# EAGLE design BT AQ DOL R5 (EAGLE 9.6.2)
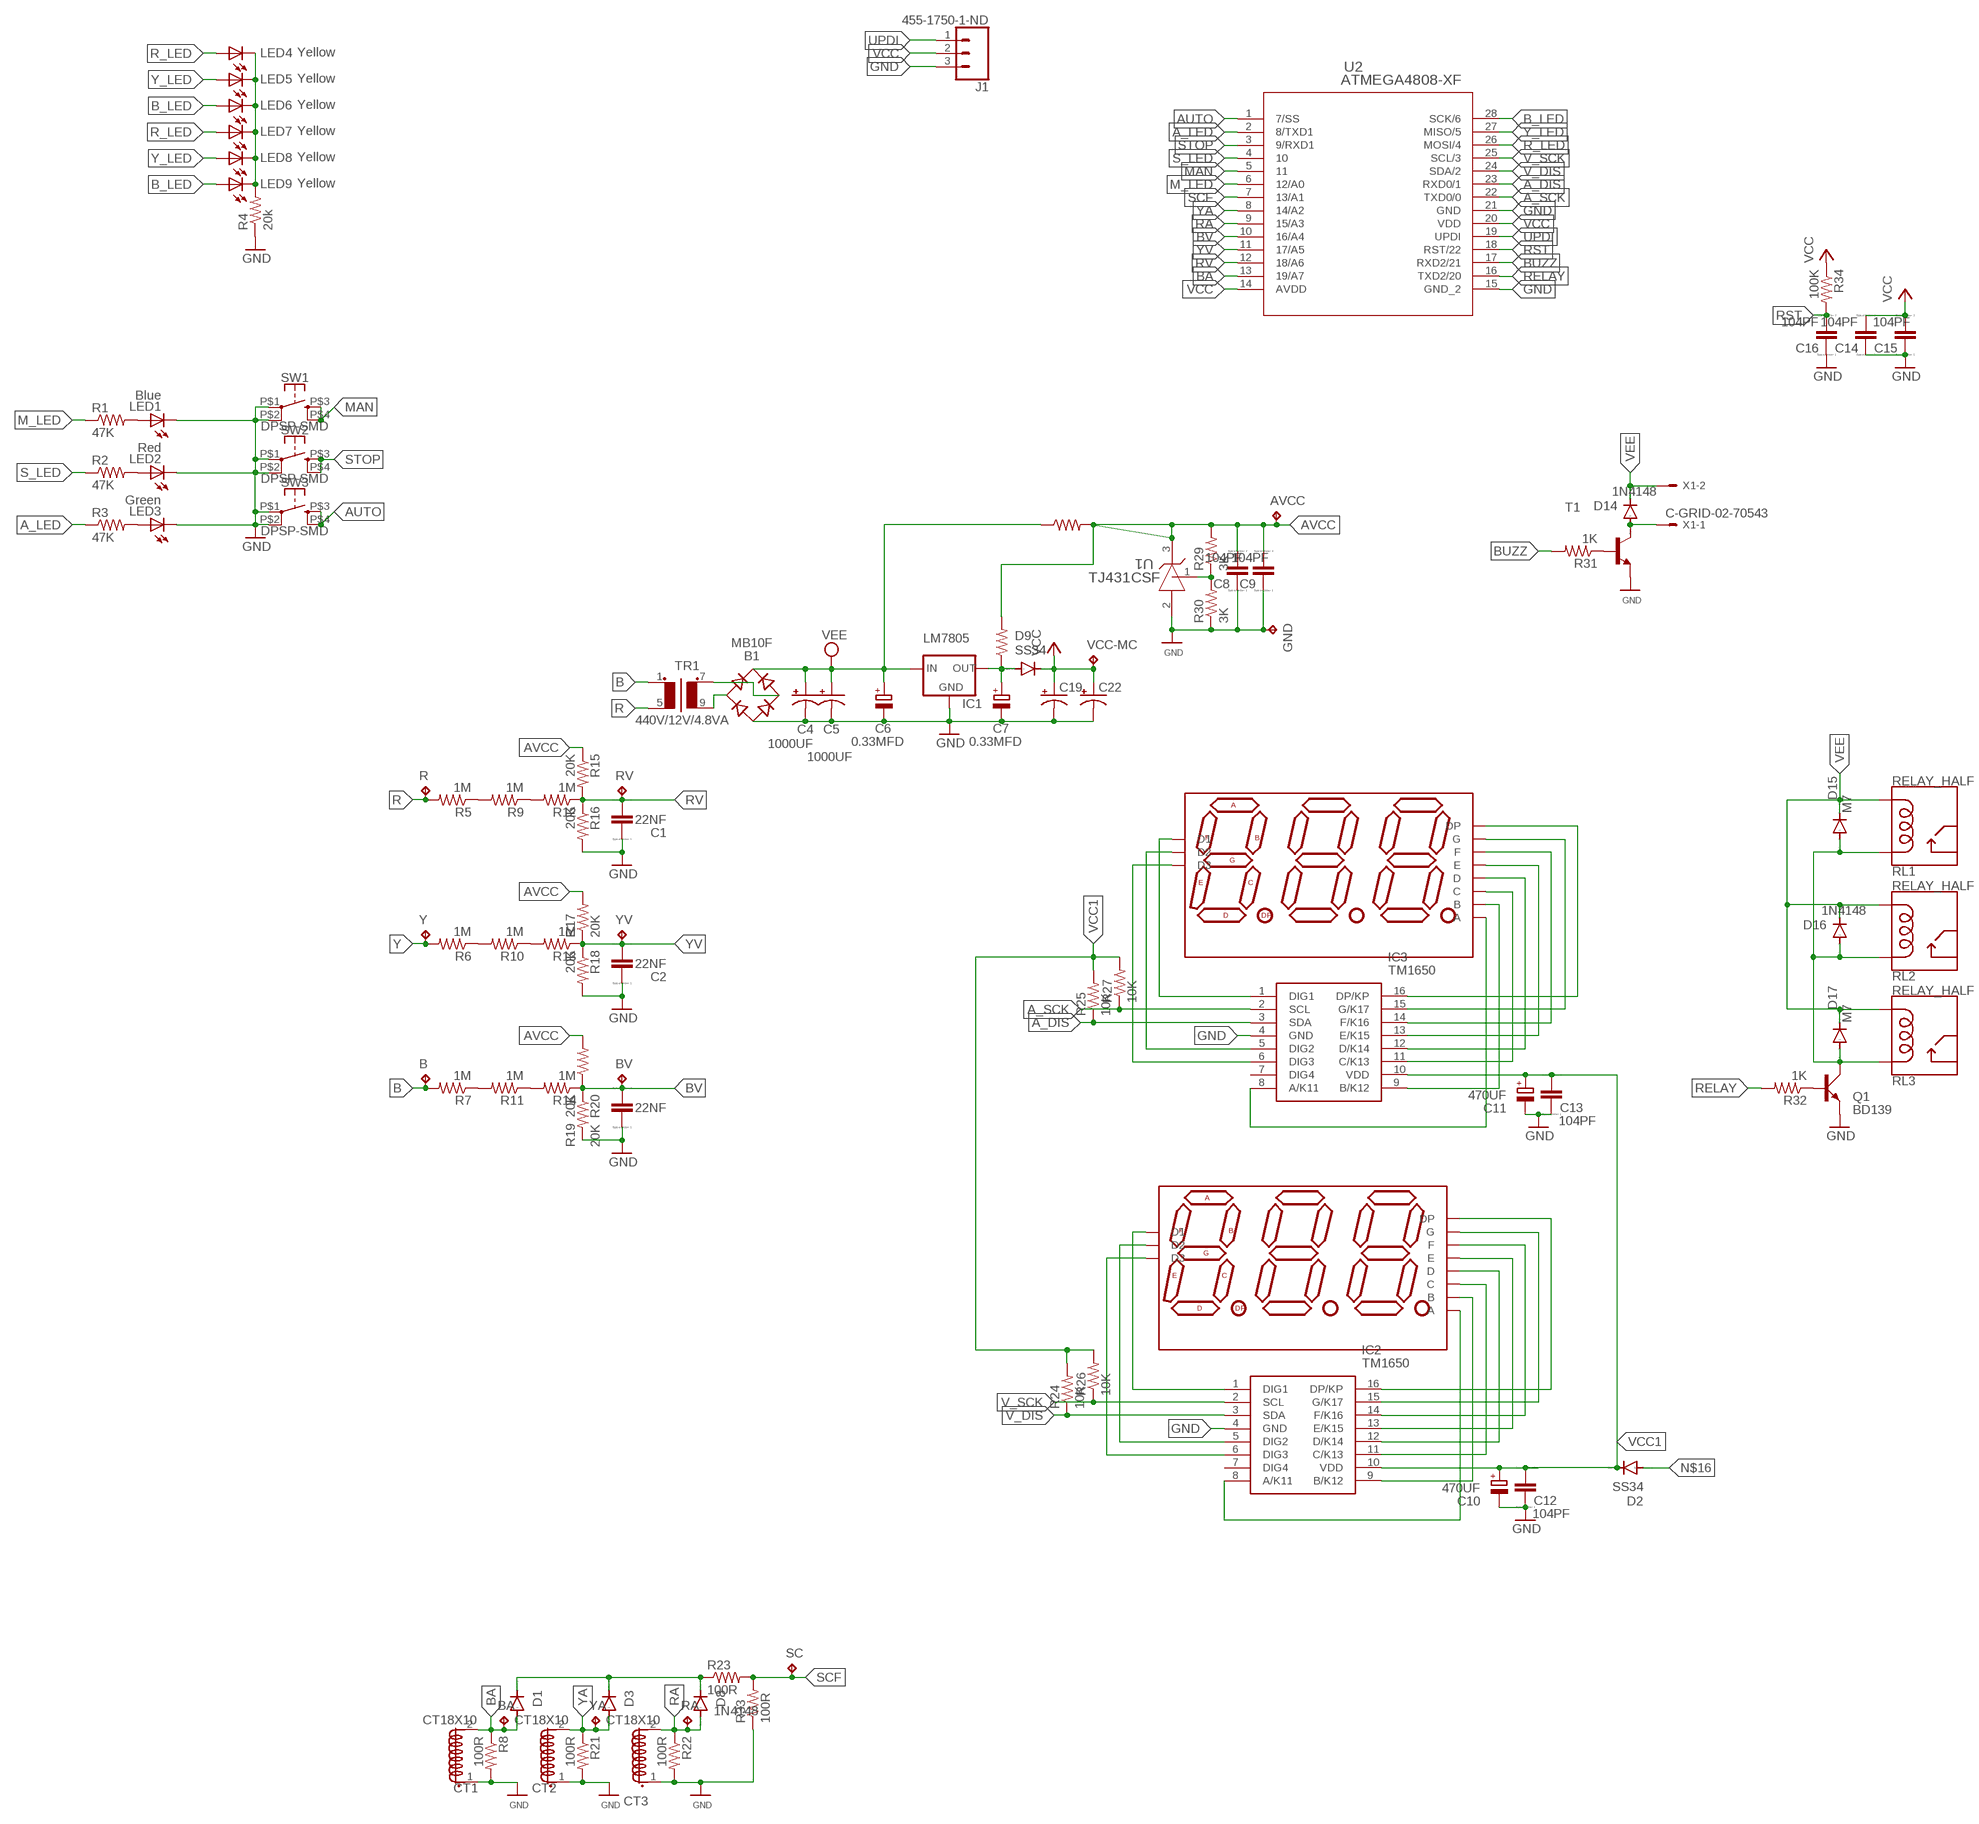
[diagram p0: schematic, sheet 1]

## Parts
AVCC  TPB1,27  [B1,27]
B  TPB1,27  [B1,27]
B1  MB10F  MB8S  [SOIC-4]
BA  TPB1,27  [B1,27]
BV  TPB1,27  [B1,27]
C1  22NF  CC1206  [C1206]
C2  22NF  CC1206  [C1206]
C3  22NF  CC1206  [C1206]
C4  1000UF  CPOL-USE3.5-10  [E3,5-10]
C5  1000UF  CPOL-USE3.5-10  [E3,5-10]
C6  0.33MFD  CPOL-EUE2.5-5  [E2,5-5]
C7  0.33MFD  CPOL-EUE2.5-5  [E2,5-5]
C8  104PF  CC1206  [C1206]
C9  104PF  CC1206  [C1206]
C10  470UF  CPOL-EUE3.5-8  [E3,5-8]
C11  470UF  CPOL-EUE3.5-8  [E3,5-8]
C12  104PF  CC1206  [C1206]
C13  104PF  CC1206  [C1206]
C14  104PF  CC1206  [C1206]
C15  104PF  CC1206  [C1206]
C16  104PF  CC1206  [C1206]
C19  CPOL-USE7.5-18  [E7,5-18]
C22  CPOL-USE7.5-18  [E7,5-18]
CT1  CT18X10  [ZMCT103C]
CT2  CT18X10  [ZMCT103C]
CT3  CT18X10  [ZMCT103C]
D1  1N4148  DIODE-MINIMELF  [MINIMELF]
D2  SS34  DIODE-DO-214AC  [DO-214AC]
D3  1N4148  DIODE-MINIMELF  [MINIMELF]
D8  1N4148  DIODE-MINIMELF  [MINIMELF]
D9  SS34  DIODE-DO-214AC  [DO-214AC]
D12  SUNR036CC3D  7SEGMENT-3DIGITDIP  [7S3D036_DIP]
D13  SUNR036CC3D  7SEGMENT-3DIGITDIP  [7S3D036_DIP]
D14  1N4148  DIODE-MINIMELF  [MINIMELF]
D15  M7  DIODE-DO-214AC  [DO-214AC]
D16  1N4148  DIODE-MINIMELF  [MINIMELF]
D17  M7  DIODE-DO-214AC  [DO-214AC]
GND  TPB1,27  [B1,27]
IC1  LM7805  78XXS  [78XXS]
IC2  TM1650  [SOIC127P604X185-16N]
IC3  TM1650  [SOIC127P604X185-16N]
J1  455-1750-1-ND  CONN_03  [1X03]
LED1  Blue  LED3MM  [LED3MM]
LED2  Red  LED3MM  [LED3MM]
LED3  Green  LED3MM  [LED3MM]
LED4  Yellow  LED3MM  [LED3MM]
LED5  Yellow  LED3MM  [LED3MM]
LED6  Yellow  LED3MM  [LED3MM]
LED7  Yellow  LED3MM  [LED3MM]
LED8  Yellow  LED3MM  [LED3MM]
LED9  Yellow  LED3MM  [LED3MM]
Q1  BD139  [TO126AV]
R  TPB1,27  [B1,27]
R1  47K  R-US_M1206  [M1206]
R2  47K  R-US_M1206  [M1206]
R3  47K  R-US_M1206  [M1206]
R4  20k  R-US_M1206  [M1206]
R5  1M  R-US_M1206  [M1206]
R6  1M  R-US_M1206  [M1206]
R7  1M  R-US_M1206  [M1206]
R8  100R  R-US_M1206  [M1206]
R9  1M  R-US_M1206  [M1206]
R10  1M  R-US_M1206  [M1206]
R11  1M  R-US_M1206  [M1206]
R12  1M  R-US_M1206  [M1206]
R13  1M  R-US_M1206  [M1206]
R14  1M  R-US_M1206  [M1206]
R15  20K  R-US_M1206  [M1206]
R16  20K  R-US_M1206  [M1206]
R17  20K  R-US_M1206  [M1206]
R18  20K  R-US_M1206  [M1206]
R19  20K  R-US_M1206  [M1206]
R20  20K  R-US_M1206  [M1206]
R21  100R  R-US_M1206  [M1206]
R22  100R  R-US_M1206  [M1206]
R23  100R  R-US_M1206  [M1206]
R24  10K  R-US_M1206  [M1206]
R25  10K  R-US_M1206  [M1206]
R26  10K  R-US_M1206  [M1206]
R27  10K  R-US_M1206  [M1206]
R28  10K  R-US_M1206  [M1206]
R29  3K  R-US_M1206  [M1206]
R30  3K  R-US_M1206  [M1206]
R31  1K  R-US_M1206  [M1206]
R32  1K  R-US_M1206  [M1206]
R33  100R  R-US_M1206  [M1206]
R34  100K  R-US_M1206  [M1206]
R35  10K  R-US_M1206  [M1206]
RA  TPB1,27  [B1,27]
RL1  RELAY_HALF  [DT90_HALF]
RL2  RELAY_HALF  [DT90_HALF]
RL3  RELAY_HALF  [DT90_HALF]
RV  TPB1,27  [B1,27]
SC  TPB1,27  [B1,27]
SW1  DPSP-SMD  [B3F-40XX-ROUND-SMD]
SW2  DPSP-SMD  [B3F-40XX-ROUND-SMD]
SW3  DPSP-SMD  [B3F-40XX-ROUND-SMD]
T1  MMUN2213LT1-NPN-SC59-BEC  [SC59-BEC]
TR1  440V/12V/4.8VA  TRANSFORMER6VA  [440V12V6VA]
U1  TJ431CSF  TJ431CSFDBZ0003A_L  [SOT-23]
U2  ATMEGA4808-XF  [SSOP28_SS_MCH]
VCC-MC  TPB1,27  [B1,27]
X1  C-GRID-02-70543  [70543-02]
Y  TPB1,27  [B1,27]
YA  TPB1,27  [B1,27]
YV  TPB1,27  [B1,27]

## Nets
A_DIS: IC3.3(SDA) R25.1 U2.23(RXD0/1)
A_LED: R3.1 U2.2(8/TXD1)
A_SCK: IC3.2(SCL) R27.1 U2.22(TXD0/0)
AUTO: SW3.P$3 SW3.P$4 U2.1(7/SS)
AVCC: AVCC.TP C8.2 C9.2 R15.1 R17.2 R19.2 R28.2 R29.2 R35.2 U1.3(CATHODE)
B: B.TP R7.2 TR1.1
B_LED: LED6.A LED9.A U2.28(SCK/6)
BA: BA.TP CT1.2(S1.2) D1.A R8.1 U2.13(19/A7)
BUZZ: R31.2 U2.17(RXD2/21)
BV: BV.TP C3.2 R14.1 R19.1 R20.1 U2.10(16/A4)
GND: B1.- C1.1 C2.1 C3.1 C4.- C5.- C6.- C7.- C8.1 C9.1 C10.- C11.- C12.1 C13.1 C14.1 C15.1 C16.1 C19.- C22.- CT1.1(S1.1) CT2.1(S1.1) CT3.1(S1.1) GND.TP IC1.GND IC2.4(GND) IC3.4(GND) J1.3 LED1.K(C) LED2.K(C) LED3.K(C) Q1.E R4.1 R8.2 R16.2 R18.2 R20.2 R21.2 R22.2 R30.1 R33.1 SW1.P$1 SW1.P$2 SW2.P$1 SW2.P$2 SW3.P$1 SW3.P$2 T1.E U1.2(ANODE) U2.15(GND_2) U2.21(GND)
M_LED: R1.1 U2.6(12/A0)
MAN: SW1.P$3 SW1.P$4 U2.5
N$1: B1.~2(AC2) TR1.7(S1)
N$2: B1.~1(AC1) TR1.9(S2)
N$3: D14.A T1.C X1.1
N$4: R31.1 T1.B
N$5: LED1.A R1.2
N$6: LED2.A R2.2
N$8: LED3.A R3.2
N$9: R29.1 R30.2 U1.1(REF)
N$10: LED4.K(C) LED5.K(C) LED6.K(C) LED7.K(C) LED8.K(C) LED9.K(C) R4.2
N$11: D1.C D3.C D8.C R23.1
N$13: R5.1 R9.2
N$14: R9.1 R12.2
N$15: R6.1 R10.2
N$16: C7.+ D2.A D9.A IC1.OUT R35.1
N$18: R7.1 R11.2
N$19: R10.1 R13.2
N$22: Q1.B R32.1
N$23: R11.1 R14.2
N$28: D13.11(A) IC3.8(A/K11)
N$29: D13.7(B) IC3.9(B/K12)
N$30: D13.4(C) IC3.11(C/K13)
N$31: D13.2(D) IC3.12(D/K14)
N$32: D13.1(E) IC3.13(E/K15)
N$33: D13.10(F) IC3.14(F/K16)
N$34: D13.5(G) IC3.15(G/K17)
N$35: D13.3(DP) IC3.16(DP/KP)
N$36: D13.12(D1) IC3.1(DIG1)
N$37: D13.9(D2) IC3.5(DIG2)
N$38: D13.8(D3) IC3.6(DIG3)
N$39: D12.11(A) IC2.8(A/K11)
N$40: D12.7(B) IC2.9(B/K12)
N$41: D12.4(C) IC2.11(C/K13)
N$44: D12.2(D) IC2.12(D/K14)
N$48: D12.1(E) IC2.13(E/K15)
N$49: D12.10(F) IC2.14(F/K16)
N$50: D12.5(G) IC2.15(G/K17)
N$51: D12.3(DP) IC2.16(DP/KP)
N$52: D12.12(D1) IC2.1(DIG1)
N$53: D12.9(D2) IC2.5(DIG2)
N$54: D12.8(D3) IC2.6(DIG3)
N$121: D15.A D16.A D17.A Q1.C RL1.1(COIL1) RL2.1(COIL1) RL3.1(COIL1)
R: R5.2 R.TP TR1.5(P2)
R_LED: LED4.A LED7.A U2.26(MOSI/4)
RA: CT3.2(S1.2) D8.A R22.1 RA.TP U2.9(15/A3)
RELAY: R32.2 U2.16(TXD2/20)
RST: C16.2 R34.2 U2.18(RST/22)
RV: C1.2 R12.1 R15.2 R16.1 RV.TP U2.12(18/A6)
S_LED: R2.1 U2.4
SCF: R23.2 R33.2 SC.TP U2.7(13/A1)
STOP: SW2.P$3 SW2.P$4 U2.3(9/RXD1)
UPDI: J1.1 U2.19(UPDI)
V_DIS: IC2.3(SDA) R24.1 U2.24(SDA/2)
V_SCK: IC2.2(SCL) R26.1 U2.25(SCL/3)
VCC: C14.2 C15.2 C19.+ C22.+ D9.C J1.2 R34.1 U2.14(AVDD) U2.20(VDD) VCC-MC.TP
VCC1: C10.+ C11.+ C12.2 C13.2 D2.C IC2.10(VDD) IC3.10(VDD) R24.2 R25.2 R26.2 R27.2
VEE [VEE]: B1.+ C4.+ C5.+ C6.+ D14.C D15.C D16.C D17.C IC1.IN R28.1 RL1.2(COIL2) RL2.2(COIL2) RL3.2(COIL2) X1.2
Y: R6.2 Y.TP
Y_LED: LED5.A LED8.A U2.27(MISO/5)
YA: CT2.2(S1.2) D3.A R21.1 U2.8(14/A2) YA.TP
YV: C2.2 R13.1 R17.1 R18.1 U2.11(17/A5) YV.TP
Unconnected: IC2.7(DIG4) IC3.7(DIG4)

## Library data of the parts
AVCC B BA BV GND R RA RV SC VCC-MC Y YA YV = testpad:TP: Test pad
B1 = rectifier:MB*S: Bridge Rectifier Source: http://www.fairchildsemi.com/ds/MB/MB6S.pdf
C1-C3 C8 C9 C12-C16 = eagle-ltspice:C: CAPACITOR, European symbol; SPICEMODEL: NONE; SPICEPREFIX: C
C4 C5 C19 C22 = rcl:CPOL-US: POLARIZED CAPACITOR, American symbol; SPICEPREFIX: C
C6 C7 C10 C11 = rcl:CPOL-EU: POLARIZED CAPACITOR, European symbol; SPICEPREFIX: C
CT1-CT3 = User Components:CT
D1-D3 D8 D9 D14-D17 = diode:DIODE-: DIODE
D12 D13 = User Components:7SEGMENT-3DIGIT
IC1 = v-reg:78XXS: VOLTAGE REGULATOR
IC2 IC3 = User Components:TM1650: The TM1650 is a dedicated LED (LED display) drive control circuit with a keyboard scan interface. The MCU input and output control digital interface, data latch, LED driver, keyboard scan, brightness adjustment and other circuits are integrated inside. The TM1650's stable performance, reliable quality, and high immunity to interference make it suitable for long-term continuous operation in 24 hours Source: Datasheet <http://www.titanmec.com/index.php/en/product/download/id/540.html>; DESCRIPTION: The TM1650 is a dedicated LED (LED display) drive control circuit with a keyboard scan interface. The MCU input and output control digital interface, data latch, LED driver, keyboard scan, brightness adjustment and other circuits are integrated inside. The TM1650's stable performance, reliable quality, and high immunity to interference make it suitable for long-term continuous operation in 24 hours; HEIGHT: 1.85mm; MANUFACTURER_NAME: TITAN MICRO ELECTRONICS; MANUFACTURER_PART_NUMBER: tm1650
J1 = SparkFun-Connectors:CONN_03: Multi connection point. Often used as Generic Header-pin footprint for 0.1 inch spaced/style header connections On any of the 0.1 inch spaced packages, you can populate with these: Break Away Headers - Straight <https://www.sparkfun.com/products/116> (PRT-00116) Break Away Male Headers - Right Angle <https://www.sparkfun.com/products/553> (PRT-00553) Female Headers <https://www.sparkfun.com/products/115> (PRT-00115) Break Away Headers - Machine Pin <https://www.sparkfun.com/products/117> (PRT-00117) Break Away Female Headers - Swiss Machine Pin <https://www.sparkfun.com/products/743> (PRT-00743) Stackable Header - 3 Pin (Female, 0.1") <https://www.sparkfun.com/products/13875> (PRT-13875) For SCREWTERMINALS and SPRING TERMINALS visit here: Screw Terimnals on SparkFun.com <https://www.sparkfun.com/search/results?term=Screw+Terminals> (5mm/3.5mm/2.54mm spacing) This device is also useful as a general connection point to wire up your design to another part of your project. Our various solder wires solder well into these plated through hole pads. Hook-Up Wire - Assortment (Stranded, 22 AWG) <https://www.sparkfun.com/products/11375> (PRT-11375) Hook-Up Wire - Assortment (Solid Core, 22 AWG) <https://www.sparkfun.com/products/11367> (PRT-11367) View the entire wire category on our website here <https://www.sparkfun.com/categories/141> Special notes: Molex polarized connector foot print use with SKU : PRT-08232 with associated crimp pins and housings.; PROD_ID: XXX-00000
LED1-LED9 = adafruit:LED: LED OSRAM: - CHIPLED LG R971, LG N971, LY N971, LG Q971, LY Q971, LO R971, LY R971 LH N974, LH R974 LS Q976, LO Q976, LY Q976 LO Q996 - Hyper CHIPLED LW Q18S LB Q993, LB Q99A, LB R99A - SideLED LS A670, LO A670, LY A670, LG A670, LP A670 LB A673, LV A673, LT A673, LW A673 LH A674 LY A675 LS A676, LA A676, LO A676, LY A676, LW A676 LS A679, LY A679, LG A679 - Hyper Micro SIDELED® LS Y876, LA Y876, LO Y876, LY Y876 LT Y87S - SmartLED LW L88C, LW L88S LB L89C, LB L89S, LG L890 LS L89K, LO L89K, LY L89K LS L896, LA L896, LO L896, LY L896 - TOPLED LS T670, LO T670, LY T670, LG T670, LP T670 LSG T670, LSP T670, LSY T670, LOP T670, LYG T670 LG T671, LOG T671, LSG T671 LB T673, LV T673, LT T673, LW T673 LH T674 LS T676, LA T676, LO T676, LY T676, LB T676, LH T676, LSB T676, LW T676 LB T67C, LV T67C, LT T67C, LS T67K, LO T67K, LY T67K, LW E67C LS E67B, LA E67B, LO E67B, LY E67B, LB E67C, LV E67C, LT E67C LW T67C LS T679, LY T679, LG T679 LS T770, LO T770, LY T770, LG T770, LP T770 LB T773, LV T773, LT T773, LW T773 LH T774 LS E675, LA E675, LY E675, LS T675 LS T776, LA T776, LO T776, LY T776, LB T776 LHGB T686 LT T68C, LB T68C - Hyper Mini TOPLED® LB M676 - Mini TOPLED Santana® LG M470 LS M47K, LO M47K, LY M47K Source: http://www.osram.convergy.de/
Q1 = transistor-power:BD139: NPN TRANSISTOR
R1-R7 R9-R20 R24-R27 R31 R32 R34 = rcl:R-US_: RESISTOR, American symbol; SPICEPREFIX: R
R8 R21-R23 R28-R30 R33 R35 = rcl:R-US_: RESISTOR, American symbol
RL1-RL3 = User Components:RELAY_HALF
SW1-SW3 = User Components:DPSP-SMD
T1 = transistor:*-NPN-: NPN Transistror BF959 corrected 2008.03.06
TR1 = User Components:TRANSFORMER
U1 = User Components:TJ431CSF; COPYRIGHT: Copyright (C) 2022 Ultra Librarian. All rights reserved.; MANUFACTURER_PART_NUMBER: TL431IDBZTG4; MFR_NAME: Texas Instruments; REFDES: RefDes; TYPE: TYPE
U2 = User Components:ATMEGA4808-XF; COPYRIGHT: Copyright (C) 2022 Ultra Librarian. All rights reserved.; MANUFACTURER_PART_NUMBER: ATMEGA4808-XF; MFR_NAME: Microchip
X1 = con-molex:C-GRID-02: CONNECTOR wire to board 2.54 mm (0.100") pitch header; MF: MOLEX; OC_FARNELL: unknown; OC_NEWARK: unknown

## Net classes
0 default: width 0.254 mm, drill 0.508 mm, clearance 0.508 mm
1 VEE: width 0.762 mm, drill 0.508 mm, clearance 0.508 mm

## Board
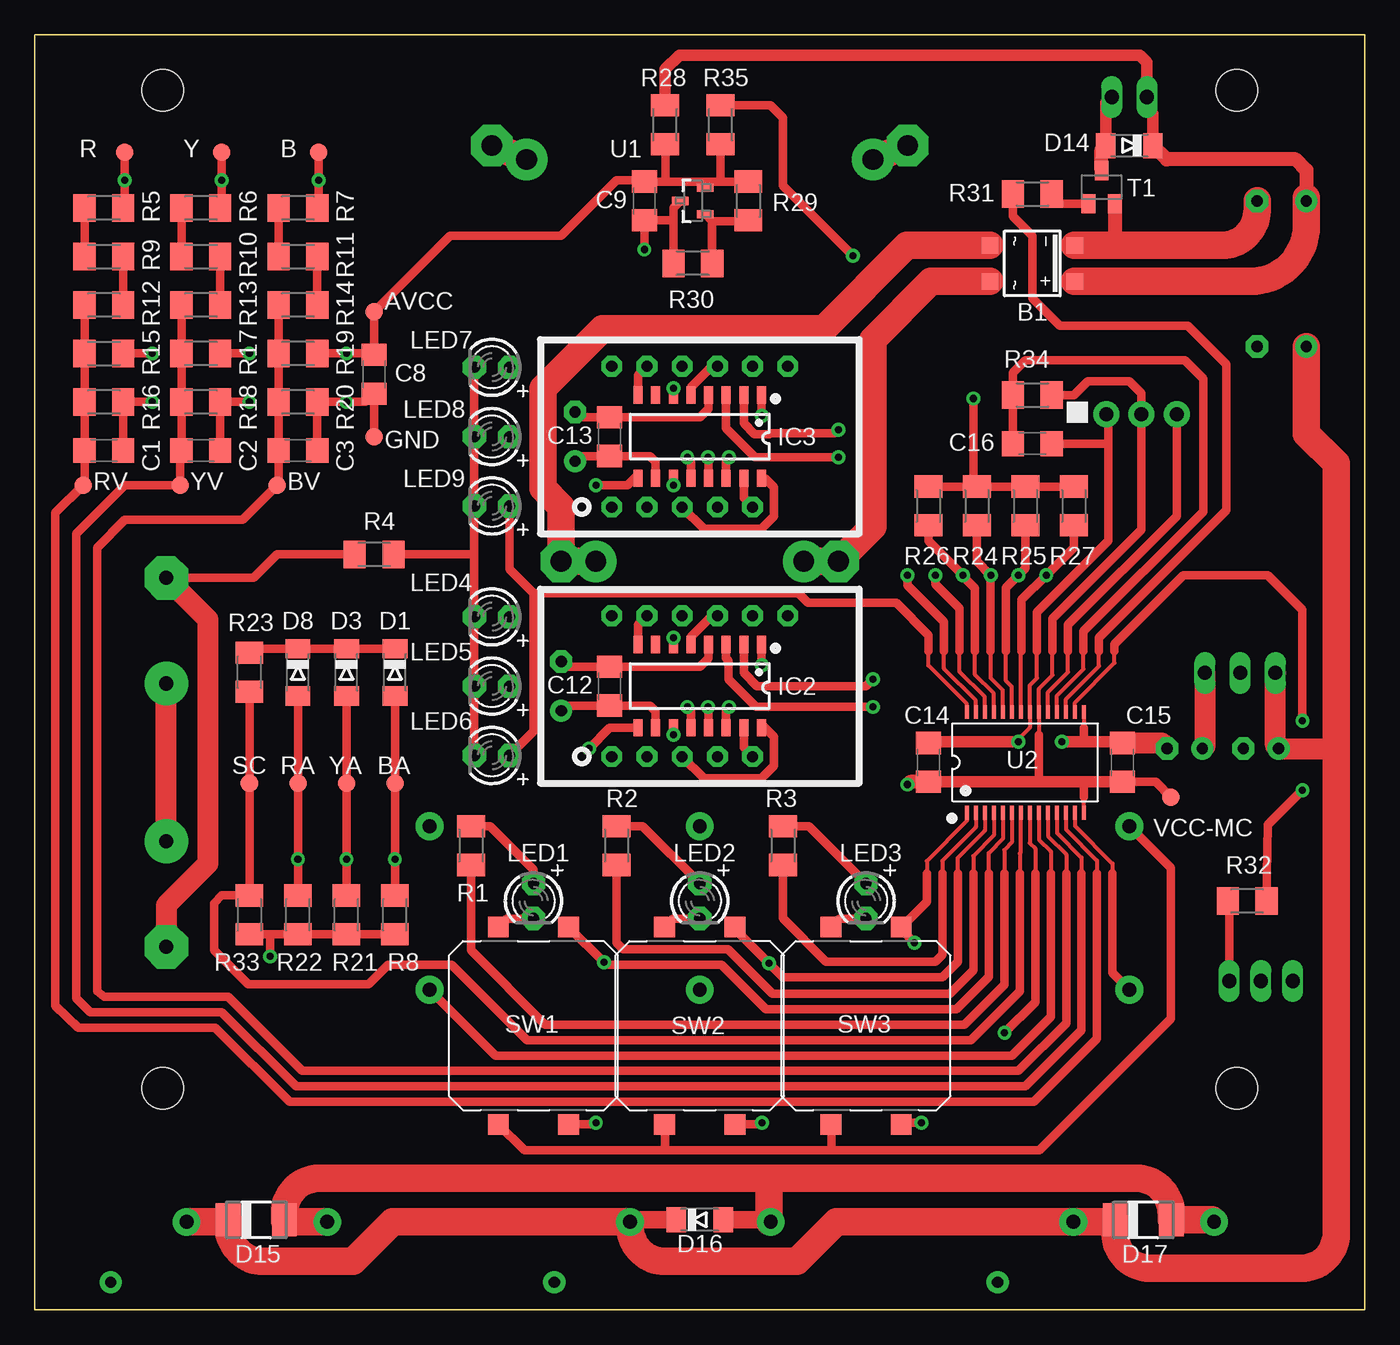
[diagram p1: board, top side]
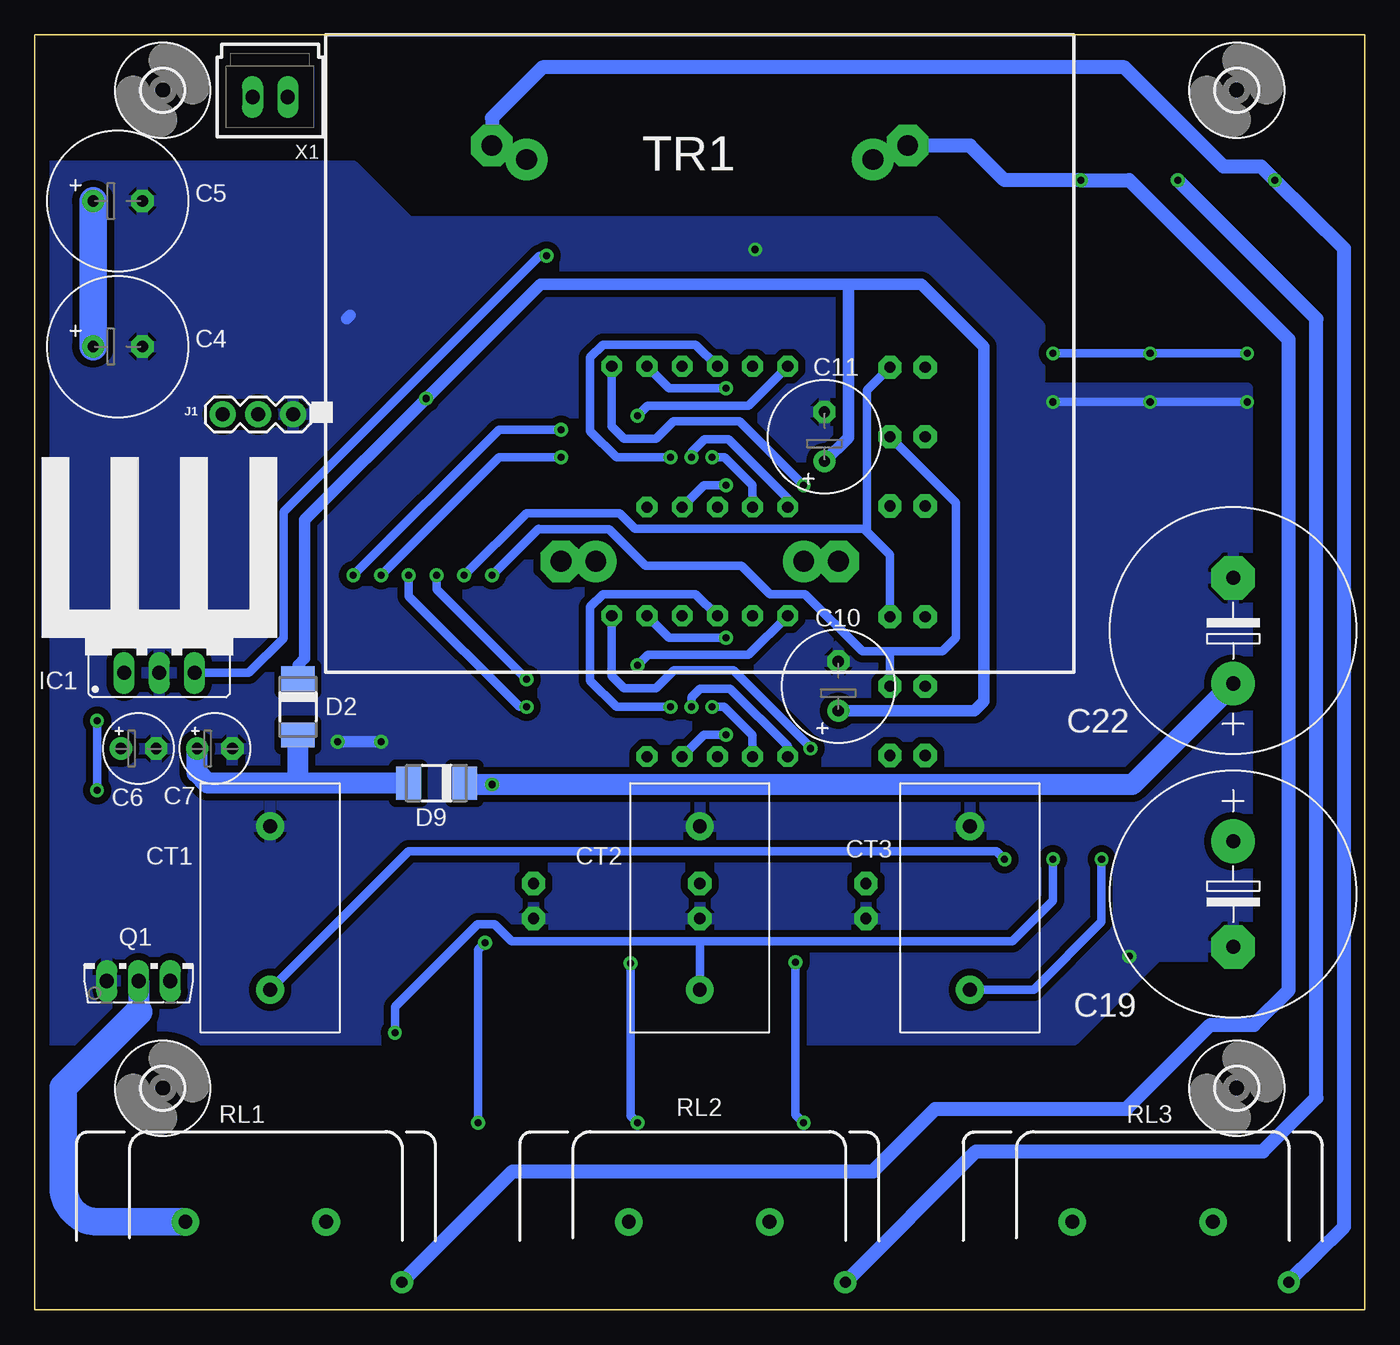
[diagram p2: board, bottom side, seen from below]

Size 96 x 92 mm. Coordinates in mm from the lower left corner, seen from the top.
Outline: 96,0 96,92 0,92 0,0 96,0
Copper layers (1*16): Top 0.035mm / dielectric 1.5mm / Bottom 0.035mm
Design rules "default *": minimum track width 6mil, minimum drill 0.35mm, track to track 6mil, track to pad 6mil, pad to pad 6mil, via to via 6mil, smd to smd 6mil, copper to edge 40mil, drill to drill 6mil, minimum pad ring 10mil, minimum via ring 8mil, stop-mask expansion 4mil, vias tented up to drill 20mil, thermal gap 10mil

### Footprints (pad centres in the part's own frame; a part is rotated, then mirrored left to right if it is on the bottom)
B1,27 = smd 1.27 x 1.27: TP 0,0
SOIC-4 = smd 1.2 x 1.2: + 1.3,3.05; - -1.3,3.05; ~1 -1.3,-3.05; ~2 1.3,-3.05
C1206 = smd 1.6 x 1.8: 1 -1.4,0; 2 1.4,0
E3,5-10 = drill 0.813 pad 1.6: + -1.778,0 | drill 0.813 pad 1.6 octagon: - 1.778,0
E2,5-5 = drill 0.813 pad 1.6: + -1.27,0 | drill 0.813 pad 1.6 octagon: - 1.27,0
E3,5-8 = drill 0.813 pad 1.6: + -1.778,0 | drill 0.813 pad 1.6 octagon: - 1.778,0
E7,5-18 = drill 1.016 pad 3.15: + -3.81,0 | drill 1.016 pad 3.15 octagon: - 3.81,0
ZMCT103C = drill 1 pad 2: 1 -5.9,0; 2 5.9,0
MINIMELF = smd 1.4 x 1.8: A 1.7,0; C -1.7,0
DO-214AC = smd 1.8 x 2.4: A 2.025,0; C -2.025,0
7S3D036_DIP = drill 0.8 pad 1.5 octagon: 1 -6.35,-5.08; 2 -3.81,-5.08; 3 -1.27,-5.08; 4 1.27,-5.08; 5 3.81,-5.08; 7 6.35,5.08; 8 3.81,5.08; 9 1.27,5.08; 10 -1.27,5.08; 11 -3.81,5.08; 12 -6.35,5.08
78XXS = drill 1.016 long: GND 0,-2.54; IN -2.54,-2.54; OUT 2.54,-2.54
SOIC127P604X185-16N = smd 1.25 x 0.65: 1 -3,4.445; 2 -3,3.175; 3 -3,1.905; 4 -3,0.635; 5 -3,-0.635; 6 -3,-1.905; 7 -3,-3.175; 8 -3,-4.445; 9 3,-4.445; 10 3,-3.175; 11 3,-1.905; 12 3,-0.635; 13 3,0.635; 14 3,1.905; 15 3,3.175; 16 3,4.445
1X03 = drill 1.016 pad 1.88: 1 0,0; 2 2.54,0; 3 5.08,0
LED3MM = drill 0.813 pad 1.676 octagon: A -1.27,0; K 1.27,0
TO126AV = drill 1.016 long: B 2.286,-1.27; C 0,-1.27; E -2.286,-1.27
M1206 = smd 1.6 x 2: 1 -1.4,0; 2 1.4,0
DT90_HALF = drill 1 pad 2: 1 -5.12,-0.15; 2 5.04,-0.15
B3F-40XX-ROUND-SMD = smd 1.5 x 1.5: P$1 -7.12,2.54; P$2 7.12,2.54; P$3 -7.12,-2.54; P$4 7.12,-2.54
SC59-BEC = smd 1 x 1.4: B -0.95,-1.2; C 0,1.2; E 0.95,-1.2
440V12V6VA = drill 1.5 pad 3 octagon: 1 -15,15; 5 -15,-15; 7 15,-10; 9 15,10
SOT-23 = smd 0.6 x 1.2: 1 -0.95,-0.9; 2 0,0.9; 3 0.95,-0.9
SSOP28_SS_MCH = smd 1 x 0.3: 1 -3.632,4.225; 2 -3.632,3.575; 3 -3.632,2.925; 4 -3.632,2.275; 5 -3.632,1.625; 6 -3.632,0.975; 7 -3.632,0.325; 8 -3.632,-0.325; 9 -3.632,-0.975; 10 -3.632,-1.625; 11 -3.632,-2.275; 12 -3.632,-2.925; 13 -3.632,-3.575; 14 -3.632,-4.225; 15 3.632,-4.225; 16 3.632,-3.575; 17 3.632,-2.925; 18 3.632,-2.275; 19 3.632,-1.625; 20 3.632,-0.975; 21 3.632,-0.325; 22 3.632,0.325; 23 3.632,0.975; 24 3.632,1.625; 25 3.632,2.275; 26 3.632,2.925; 27 3.632,3.575; 28 3.632,4.225
3,0 = hole 3: 0,0
70543-02 = drill 1.016 long: 1 -1.27,0; 2 1.27,0

### Placement (x,y rotation side)
AVCC  24.5,72 0 top
B  20.5,83.5 0 top
B1  72,75.5 270 top
BA  26,38 0 top
BV  17.5,59.5 0 top
C1  5,62 180 top
C2  12,62 180 top
C3  19,62 180 top
C4  90,69.5 0 bottom
C5  90,80 0 bottom
C6  88.5,40.5 0 bottom
C7  83,40.5 0 bottom
C8  24.5,67.5 90 top
C9  44,80 90 top
C10  38,45 90 bottom
C11  39,63 90 bottom
C12  41.5,45 270 top
C13  41.5,63 270 top
C14  64.5,39.5 270 top
C15  78.5,39.5 270 top
C16  72,62.5 180 top
C19  9.5,30 270 bottom
C22  9.5,49 90 bottom
CT1  79,29 270 bottom
CT2  48,29 270 bottom
CT3  28.5,29 270 bottom
D1  26,46 270 top
D2  77,43.5 270 bottom
D3  22.5,46 270 top
D8  19,46 270 top
D9  67,38 180 bottom
D12  48,45 0 top
D13  48,63 0 top
D14  79,84 180 top
D15  16,6.5 0 top
D16  48,6.5 0 top
D17  80,6.5 0 top
GND  24.5,63 0 top
IC1  87,48.5 0 bottom
IC2  48,45 270 top
IC3  48,63 270 top
J1  82.42,64.6 0 bottom
LED1  36,29.5 270 top
LED2  48,29.5 270 top
LED3  60,29.5 270 top
LED4  33,50 180 top
LED5  33,45 180 top
LED6  33,40 180 top
LED7  33,68 180 top
LED8  33,63 180 top
LED9  33,58 180 top
Q1  88.5,25 0 bottom
R  6.5,83.5 0 top
R1  31.5,33.5 90 top
R2  42,33.5 90 top
R3  54,33.5 90 top
R4  24.5,54.5 0 top
R5  5,79.5 0 top
R6  12,79.5 0 top
R7  19,79.5 0 top
R8  26,28.5 270 top
R9  5,76 180 top
R10  12,76 180 top
R11  19,76 180 top
R12  5,72.5 0 top
R13  12,72.5 0 top
R14  19,72.5 0 top
R15  5,69 180 top
R16  5,65.5 0 top
R17  12,69 0 top
R18  12,65.5 0 top
R19  19,69 0 top
R20  19,65.5 0 top
R21  22.5,28.5 270 top
R22  19,28.5 270 top
R23  15.5,46 270 top
R24  68,58 90 top
R25  71.5,58 90 top
R26  64.5,58 90 top
R27  75,58 90 top
R28  45.5,85.5 270 top
R29  51.5,80 90 top
R30  47.5,75.5 0 top
R31  72,80.5 180 top
R32  87.5,29.5 0 top
R33  15.5,28.5 90 top
R34  72,66 180 top
R35  49.5,85.5 270 top
RA  19,38 0 top
RL1  80,6.5 0 bottom
RL2  48,6.5 0 bottom
RL3  16,6.5 0 bottom
RV  3.5,59.5 0 top
SC  15.5,38 0 top
SW1  36,20.5 90 top
SW2  48,20.5 90 top
SW3  60,20.5 90 top
T1  77,81 0 top
TR1  48,69 270 bottom
U1  47.5,80 90 top
U2  71.5,39.5 90 top
U$1  [3,0]  86.75,16 0 bottom
U$2  [3,0]  9.25,16 0 bottom
U$3  [3,0]  86.75,88 0 bottom
U$4  [TO220_17X13]  87,55 0 bottom
U$8  [3,0]  9.25,88 0 bottom
VCC-MC  82,37 0 top
X1  79,87.5 180 bottom
Y  13.5,83.5 0 top
YA  22.5,38 0 top
YV  10.5,59.5 0 top

### Tracks (layer width: path | path; a pad name or v marks a point on that pad's centre or on a via)
A_DIS  (via drill 0.51 pad 1)
  Top 0.305: 70.11,47.5 70.11,45.38 70.53,44.97 U2.23
  Top 0.61: v58,61.5 52,61.5 49.91,63.59 49.91,65 49.91,65.73 IC3.3 | 70.11,47.5 70.11,52.11 v71,53 71.5,53.5 R25.1
  Bottom 0.61: v58,61.5 62.5,61.5 v71,53
A_LED
  Top 0.305: U2.2 67.92,34.82 65.5,32.4 65.5,31.5
  Top 0.61: 65.5,31.5 65.5,25.62 65,25.12 57.12,25.12 54,28.24 R3.1
A_SCK  (via drill 0.51 pad 1)
  Top 0.305: 71.22,47.5 71.17,47.45 U2.22
  Top 0.61: R27.1 75,55 v73,53 71.22,51.22 71.22,47.5 | v58,63.5 57.73,63.23 53.09,63.23 53.04,63.19 51.96,63.19 51.17,63.97 IC3.2
  Bottom 0.61: v58,63.5 62.5,63.5 v73,53
AUTO  (via drill 0.51 pad 1)
  Top 0.305: U2.1 67.28,35.27 64.38,32.38 64.38,31.5
  Top 0.61: 64.38,31.5 64.38,29.46 SW3.P$4 62.54,27.46 v63.5,26.5 | SW3.P$3 62.66,13.5 v64,13.5
  Bottom 0.61: v63.5,26.5 64,26 v64,13.5
AVCC  (via drill 0.51 pad 1)
  Top 0.61: v8.5,69 R15.1 | v15.5,69 R17.2 | R19.2 v22.5,69 24.4,69 arc-90 C8.2 AVCC.TP 30,77.5 38,77.5 42,81.5 43.9,81.5 C9.2 45.6,81.4 | 45.6,81.4 48.5,81.4 | 48.5,81.4 49.5,81.4 | 49.5,81.4 R29.2 | U1.3 48.5,81.05 48.5,81.4 | R28.2 45.54,83 45.54,81.46 45.6,81.4 | R35.2 49.5,81.4
  Bottom 0.61: v8.5,69 v15.5,69 v22.5,69
B  (via drill 0.51 pad 1, 0.8 pad 1.6, 1.5 pad 3)
  Top 0.61: B.TP v20.5,81.5 20.5,79.6 R7.2
  Top 2: v35.5,83 TR1.1
  Bottom 1: v69.5,2 61.5,10 35.5,10 31,14.5 17.2,14.5 11.14,20.56 8,20.56 5.5,23.06 5.5,70 17,81.5 v20.5,81.5 26,81.5 28.5,84 TR1.1
B_LED
  Top 0.305: 64.52,47.5 64.5,47.48 64.5,46.5 67.28,43.73 U2.28
  Top 0.61: 64.52,47.5 64.52,48.68 62.2,51 55.81,51 55.13,51.69 36,51.69 | LED6.A 36,41.73 36,51.69 | 36,51.69 34.27,53.42 LED9.A
BA  (via drill 0.51 pad 1)
  Top 0.305: U2.13 75.08,34.91 77.79,32.2 77.79,31.5
  Top 0.61: R8.1 v26,32.5 BA.TP D1.A | CT1.2 77.79,24.31 77.79,31.5
  Bottom 0.61: v26,32.5 26.59,33.09 69.01,33.09 CT1.2
BUZZ
  Top 0.305: 76.81,47.5 76.81,46.45 74.42,44.06 U2.17
  Top 0.61: R31.2 70.6,78.9 72,77.5 72,73 74,71 83.21,71 86,68.21 86,57.68 76.81,48.49 76.81,47.5
BV
  Top 0.305: U2.10 73.12,34.17 74.44,32.85 74.44,31.5
  Top 0.61: R14.1 R19.1 R20.1 C3.2 17.6,59.4 BV.TP 15,57 6.5,57 4.5,55 4.5,23 5.01,22.6 13.95,22.6 19.32,17.23 71,17.23 74.44,20.68 74.44,31.5
GND  (via drill 0.51 pad 1)
  Top 0.305: U2.15 75.72,42 75.73,41.99 | 72.34,47.5 72.34,45.57 71.83,45.05 U2.21 71.83,42 71,41.17 v71,41
  Top 0.61: C1.1 R16.2 v8.5,65.5 | C2.1 R18.2 v15.5,65.5 | C3.1 R20.2 v22.5,65.5 23.9,65.5 C8.1 GND.TP | 77.5,62.5 77.5,55.5 72.34,50.34 72.34,47.5 | 76,41 75.73,41.27 75.73,41.99 | C11.- 39.38,64.4 C13.1 48.03,64.4 48.63,65 IC3.4 | SW3.P$2 58.07,28.23 LED3.K | SW2.P$2 46.07,28.23 LED2.K | SW1.P$2 34.07,28.23 LED1.K | C16.1 77.5,62.5 | U1.2 46.1,79.5 46.1,78.5 | 46.1,78.5 R30.1 | 46.1,78.5 46,78.6 C9.1 v44,76.5 | R22.2 R33.1 | R8.2 R21.2 R22.2 | 77.5,62.5 77.5,64.44 J1.3 | IC2.4 48.63,47 48.03,46.4 C12.1 38.38,46.4 C10.- | SW1.P$1 35.34,11.5 45.5,11.5 | CT1.1 82,31.9 82,21 72.5,11.5 57.5,11.5 | 45.5,11.5 57.5,11.5 | 45.5,13.34 45.5,11.5 | 57.5,13.34 57.5,11.5 | R22.2 17,27.1 v17,25.5 | R4.1 17.5,54.5 15.81,52.81 C22.-
  Top 0.813: 45.5,13.34 SW2.P$1 | 57.5,13.34 SW3.P$1 | v74.13,41 76,41 78.4,41 C15.1 | C14.1 64.6,41 v71,41
  Top 1: T1.E 77.95,76.85 78,76.8
  Top 1.5: C15.1 81.33,40.9 C7.- | C22.- 12.5,49.81 12.5,32.19 9.5,29.19 C19.-
  Top 2: B1.- 78,76.8 85.68,76.8 arc90 88.22,79.34 C5.-
  Bottom 0.61: v8.5,65.5 v15.5,65.5 v22.5,65.5
  Bottom 0.813: 73.25,71.75 73.5,71.5 | v71,41 v74.13,41
  pour Bottom: 96,19.5 21,19.5 15,25.5 8.5,25.5 8.5,66.5 23.5,66.5 23.5,71 31,78.5 69,78.5 73,82.5 96,82.5
M_LED
  Top 0.305: U2.6 70.53,33.73 69.97,33.17 69.97,31.5
  Top 0.61: R1.1 31.5,25.93 36.84,20.59 67.09,20.59 69.97,23.46 69.97,31.5
MAN  (via drill 0.51 pad 1)
  Top 0.305: U2.5 69.88,33.98 68.85,32.95 68.85,31.5
  Top 0.61: 68.85,31.5 68.85,24.04 66.52,21.71 52.79,21.71 49.59,24.91 41.25,24.91 v41.08,25.08 SW1.P$4 | v40.5,13.5 40.38,13.38 SW1.P$3
  Bottom 0.61: v41.08,25.08 41.08,14.08 v40.5,13.5
N$1  (via drill 1.5 pad 3)
  Top 2: B1.~2 64.7,74.2 60.5,70 60.5,56.5 TR1.7 v55.5,54
N$2  (via drill 1.5 pad 3)
  Top 2: B1.~1 62.95,76.8 56.95,70.8 40.99,70.8 36.69,66.5 36.69,59.27 38,57.96 TR1.9 v40.5,54
N$3
  Top 0.813: X1.1 77.3,87.07 D14.A
  Top 1: T1.C 77,83.7 D14.A
N$4
  Top 0.61: R31.1 74.1,79.8 T1.B
N$5
  Top 0.61: R1.2 32.87,34.9 36,31.77 LED1.A
N$6
  Top 0.61: R2.2 43.87,34.9 LED2.A
N$8
  Top 0.61: R3.2 55.87,34.9 LED3.A
N$9
  Top 0.61: R30.2 48.9,78.55 | 48.9,78.55 U1.1 | R29.1 51.45,78.55 48.9,78.55
N$10
  Top 0.61: LED7.K LED8.K LED9.K 31.73,54.5 | 31.73,54.5 LED4.K LED5.K LED6.K | R4.2 31.73,54.5
N$11
  Top 0.61: R23.1 15.8,47.7 D8.C D3.C D1.C
N$13
  Top 0.61: R5.1 R9.2
N$14
  Top 0.61: R12.2 R9.1
N$15
  Top 0.61: R10.2 R6.1
N$16  (via drill 0.51 pad 1)
  Top 0.61: v59.05,76.05 54,81.11 54,86 53.1,86.9 R35.1
  Top 1.5: IC1.OUT 84.46,40.69 C7.+
  Bottom 0.61: IC1.OUT 80.54,45.96 78.04,48.46 78.04,57.56 59.55,76.05 v59.05,76.05
  Bottom 1.5: C7.+ 84.27,38.77 83.5,38 77,38 | D9.A 77,38 | 77,38 D2.A
N$18
  Top 0.61: R7.1 R11.2
N$19
  Top 0.61: R10.1 R13.2
N$22
  Top 0.61: R32.1 86.21,29.39 Q1.B
N$23
  Top 0.61: R14.2 R11.1
N$28
  Top 0.61: IC3.8 43.55,67.44 D13.11
N$29  (via drill 0.51 pad 1)
  Top 0.61: v40.5,59.5 42.79,59.5 43.55,60.27 IC3.9
  Bottom 0.61: D13.7 54.35,63.73 53.47,62.86 51.14,62.86 49.88,64.12 45.12,64.12 v40.5,59.5
N$30  (via drill 0.51 pad 1)
  Top 0.61: IC3.11 v46.1,59.5
  Bottom 0.61: v46.1,59.5 47.69,59.5 D13.4
N$31  (via drill 0.51 pad 1)
  Top 0.61: v47.1,61.5 47.36,61.14 47.36,61.03 47.37,61.02 IC3.12
  Bottom 0.61: D13.2 44.19,59.48 46.21,61.5 v47.1,61.5
N$32  (via drill 0.51 pad 1)
  Top 0.61: v48.6,61.5 48.63,61.37 IC3.13
  Bottom 0.61: D13.1 41.65,58.52 45.94,62.81 47.64,62.81 48.6,61.86 v48.6,61.5
N$33  (via drill 0.51 pad 1)
  Top 0.61: v50.1,61.5 49.91,61.41 IC3.14
  Bottom 0.61: v50.1,61.5 54.02,61.5 55.91,63.4 55.91,68.73 55,69.64 48.29,69.64 D13.10
N$34
  Top 0.61: D13.5 51.17,58.55 IC3.15
N$35
  Top 0.61: D13.3 48.29,56.36 52.46,56.36 53.37,57.27 53.37,59.34 52.71,60 IC3.16
N$36  (via drill 0.51 pad 1)
  Top 0.61: v52.5,64.5 52.45,64.56 52.45,65.73 IC3.1
  Bottom 0.61: v52.5,64.5 51.77,65.23 44.5,65.23 D13.12
N$37
  Top 0.61: D13.9 48.87,68.08 47.37,66.58 IC3.5
N$38  (via drill 0.51 pad 1)
  Top 0.61: IC3.6 v46.09,66.5 v46.1,66.5
  Bottom 0.61: v46.1,66.5 50.23,66.5 D13.8
N$39
  Top 0.61: IC2.8 43.55,49.45 D12.11
N$40  (via drill 0.51 pad 1)
  Top 0.61: v40,40.5 41.49,41.99 43.28,41.99 43.55,42.27 IC2.9
  Bottom 0.61: v40,40.5 40,40.58 45.55,46.13 49.87,46.13 51.14,44.86 53.47,44.86 54.35,45.73 D12.7
N$41  (via drill 0.51 pad 1)
  Top 0.61: IC2.11 46.09,41.59 v46.1,41.5
  Bottom 0.61: D12.4 47.69,41.5 v46.1,41.5
N$44  (via drill 0.51 pad 1)
  Top 0.61: IC2.12 47.37,43.23 v47.1,43.5
  Bottom 0.61: v47.1,43.5 46.24,43.5 44.19,41.45 D12.2
N$48  (via drill 0.51 pad 1)
  Top 0.61: IC2.13 48.63,43.37 v48.6,43.5
  Bottom 0.61: D12.1 41.65,40.65 45.81,44.81 48,44.81 48.6,44.21 v48.6,43.5
N$49  (via drill 0.51 pad 1)
  Top 0.61: v50.1,43.5 49.91,43.41 49.91,43 49.91,42.27 IC2.14
  Bottom 0.61: v50.1,43.5 54.02,43.5 55.91,45.4 55.91,50.73 55,51.64 48.29,51.64 D12.10
N$50
  Top 0.61: IC2.15 51.17,40.55 D12.5
N$51
  Top 0.61: D12.3 48.29,38.36 52.46,38.36 53.37,39.27 53.37,41.34 52.45,42.27 IC2.16
N$52  (via drill 0.51 pad 1)
  Top 0.61: v52.5,46.5 52.45,46.55 52.45,47.5 52.45,47.73 IC2.1
  Bottom 0.61: v52.5,46.5 51.75,47.25 44.48,47.25 D12.12
N$53
  Top 0.61: IC2.5 47.37,48.58 48.87,50.08 D12.9
N$54  (via drill 0.51 pad 1)
  Top 0.61: IC2.6 v46.09,48.49 v46.1,48.5
  Bottom 0.61: v46.1,48.5 50.23,48.5 D12.8
N$121
  Top 1.27: D16.A 52.97,6.5 arc-90 RL2.1
  Top 2: RL3.1 18.18,6.35 arc-90 D15.A 18.02,6.96 arc-90 20.57,9.5 53,9.5 | RL2.1 arc-90 53,6.47 53,9.5 | RL1.1 84.97,6.5 D17.A 82.03,6.96 arc90 79.48,9.5 53,9.5
  Bottom 1.5: Q1.C 88.5,21.5
  Bottom 2: RL1.1 91.39,6.35 arc90 93.93,8.89 93.93,16.07 88.5,21.5
R  (via drill 0.51 pad 1, 0.8 pad 1.6, 1.5 pad 3)
  Top 0.61: R5.2 6.5,79.6 v6.5,81.5 R.TP
  Top 2: v60.5,83 TR1.5
  Bottom 1: v5.5,2 5.5,2.07 1.5,6 1.5,76.57 v6.5,81.5 7.5,82.5 10.2,82.5 17.35,89.65 59.35,89.65 63,86 TR1.5
R_LED  (via drill 0.51 pad 1)
  Top 0.305: 66.75,47.5 66.75,46.04 68.58,44.22 U2.26
  Top 0.61: v65,53 65,52.36 66.75,50.6 66.75,47.5
  Bottom 0.61: LED4.A 34.27,54.48 35.92,56.13 | v65,53 60.52,57.48 53.8,57.48 52.68,56.36 36.15,56.36 35.92,56.13 | LED7.A 35.92,66.35 35.92,56.13
RA  (via drill 0.51 pad 1)
  Top 0.305: U2.9 72.47,33.92 73.32,33.08 73.32,31.5
  Top 0.61: D8.A RA.TP v19,32.5 R22.1 | CT3.2 33.25,18.35 70.54,18.35 73.32,21.14 73.32,31.5
  Bottom 0.61: CT3.2 23.9,23.1 19,28 v19,32.5
RELAY  (via drill 0.51 pad 1)
  Top 0.305: 77.93,47.5 77.93,46.67 75.08,43.81 U2.16
  Top 0.61: v91.5,37.5 89,35 R32.2 | 77.93,47.5 77.93,48.03 82.9,53 89,53 91.5,50.5 v91.5,42.5
  Bottom 0.61: v91.5,37.5 v91.5,42.5
RST
  Top 0.305: 75.69,47.5 75.69,46.23 73.78,44.31 U2.18
  Top 0.61: C16.2 R34.2 70.6,67.6 71.5,68.5 83,68.5 84.33,67.17 84.33,57.59 75.69,48.95 75.69,47.5
RV
  Top 0.305: U2.12 74.42,34.67 76.68,32.42 76.68,31.5
  Top 0.61: R12.1 R15.2 R16.1 C1.2 3.6,59.5 RV.TP 1.5,57.5 1.5,21.95 3.13,20.37 13.03,20.37 18.39,15 72.11,15 76.68,19.56 76.68,31.5
S_LED
  Top 0.305: U2.4 69.22,34.23 67.73,32.73 67.73,31.5
  Top 0.61: R2.1 42,26.5 42.47,26.03 50.05,26.03 53.26,22.82 66.05,22.82 67.73,24.5 67.73,31.5
SCF
  Top 0.305: U2.7 71.17,33 71.09,32.91 71.09,31.5
  Top 0.61: R23.2 SC.TP R33.2 13.5,29.9 12.95,29.35 12.95,25.95 15.4,23.5 24.1,23.5 25.51,24.91 30.09,24.91 35.53,19.47 67.56,19.47 71.09,23 71.09,31.5
STOP  (via drill 0.51 pad 1)
  Top 0.305: U2.3 68.58,34.58 66.62,32.62 66.62,31.5
  Top 0.61: 66.62,31.5 66.62,25.12 65.5,24 54.5,24 54.16,24 54,24 v53,25 50.54,27.46 SW2.P$4 | v52.5,13.5 52.38,13.38 SW2.P$3
  Bottom 0.61: v53,25 53,14 v52.5,13.5
UPDI
  Top 0.305: 74.58,47.5 74.58,46.01 73.12,44.56 U2.19
  Top 0.61: 74.58,47.5 74.58,49.42 82.42,57.26 J1.1
V_DIS  (via drill 0.51 pad 1)
  Top 0.305: 68.99,47.5 68.99,45.6 69.88,44.72 U2.24
  Top 0.61: IC2.3 49.91,47 50.06,46.85 50.06,45.51 52.06,43.5 v60.5,43.5 | R24.1 68,54 68.99,53.01 | 68.99,53.01 68.99,47.5 | v69,53 68.99,53.01
  Bottom 0.61: v69,53 69,51.5 61,43.5 v60.5,43.5
V_SCK  (via drill 0.51 pad 1)
  Top 0.305: 67.87,47.5 67.87,45.82 69.22,44.47 U2.25
  Top 0.61: v60.5,45.5 60,45 52.15,45 51.17,45.97 IC2.2 | R26.1 64.5,55.5 v67,53 67,52.94 67.87,52.07 67.87,47.5
  Bottom 0.61: v67,53 67,52 v60.5,45.5
VCC  (via drill 0.51 pad 1)
  Top 0.305: 73.46,47.5 73.46,45.79 72.47,44.81 U2.20 72.47,41.5 | U2.14 75.72,37
  Top 0.61: 73.46,47.5 73.46,49.88 79.88,56.3 J1.2 79.88,66.12 79,67 76,67 75,66 R34.1 | C15.2 80.9,38.1 VCC-MC.TP | 75.72,37 75.72,37.88 75.5,38.1 | 72.47,41.5 72.47,38.12 72.5,38.1
  Top 0.813: C15.2 75.5,38.1 72.5,38.1 C14.2
  Top 1: C14.2 63.2,38.1 v63,37.9
  Top 1.5: C19.+ C22.+
  Bottom 1.5: C22.+ 16.79,37.9 v63,37.9 64.88,37.9 D9.C
VCC1  (via drill 0.51 pad 1)
  Top 0.61: IC2.10 44.83,43.17 44.4,43.6 C12.2 38.38,43.6 C10.+ | IC3.10 44.83,61.17 44.4,61.6 C13.2 39.38,61.6 C11.+ | v67.75,65.75 67.75,59.65 R24.2 | R24.2 R25.2 R27.2 | R24.2 R26.2
  Bottom 0.813: 37.28,74 32,74 27.5,69.5 27.5,53.5 27.5,43.91 28.19,43.22 C10.+ | C11.+ 37.28,62.94 37.28,74 | D2.C 77,46.52 76.5,47.02 76.5,57 v67.75,65.75 59.5,74 37.28,74
VEE
  Top 0.813: D14.C 80.7,86.3 80.27,86.73 X1.2 80.27,90 79.74,90.53 46.53,90.53 45.5,89.5 R28.1
  Top 1.016: D14.C 81.7,83 91,83 91.78,82.22 91.78,80.22 C5.+ | 93.7,40.5 arc90 93.9,40.7
  Top 1.27: RL2.2 arc-90 43.11,6.5 D16.C
  Top 1.5: 93.9,40.7 93.7,40.5 C6.+ 89.54,40.73 IC1.IN
  Top 2: B1.+ 87.74,74.2 arc90 91.78,78.24 91.78,80.22 | RL3.2 13.82,6.35 arc90 D15.C 13.97,6.04 arc90 16.52,3.5 23,3.5 25.85,6.35 RL2.2 42.96,6.04 arc90 45.5,3.5 55,3.5 57.85,6.35 RL1.2 77.83,6.35 arc90 D17.C 77.97,5.54 arc90 80.52,3 91.39,3 arc90 93.93,5.54 93.93,40.73 | 93.93,40.73 93.7,40.5 | C4.+ 91.78,63.22 93.93,61.07 93.93,40.73
  Bottom 2: C5.+ C4.+
Y  (via drill 0.51 pad 1, 0.8 pad 1.6)
  Top 0.61: Y.TP v13.5,81.5 13.5,79.6 R6.2
  Bottom 1: v37.5,2 28.06,11.44 7.36,11.44 3.5,15.3 3.5,71.5 v13.5,81.5
Y_LED  (via drill 0.51 pad 1)
  Top 0.305: 65.64,47.5 65.64,46.26 67.92,43.97 U2.27
  Top 0.61: 65.64,47.5 65.64,49.64 63,52.28 v63,53
  Bottom 0.61: LED8.A 29.5,58.23 29.5,48.5 30.5,47.5 34.5,47.5 | v63,53 59.63,56.37 59.58,56.31 54.54,56.31 51.92,53.7 45,53.7 42.95,51.64 40.41,51.64 36.27,47.5 34.5,47.5 | LED5.A 34.27,47.27 34.5,47.5
YA  (via drill 0.51 pad 1)
  Top 0.305: U2.8 71.83,33.67 72.21,33.29 72.21,31.5
  Top 0.61: R21.1 v22.5,32.5 YA.TP D3.A | 72.21,31.5 72.21,22.21 v70,20
  Bottom 0.61: 48,26.58 25.42,26.58 22.5,29.5 v22.5,32.5 | CT2.2 48,26.58 | 48,26.58 61.58,26.58 62.81,27.81 64.04,27.81 70,21.86 v70,20
YV
  Top 0.305: U2.11 73.78,34.42 75.56,32.64 75.56,31.5
  Top 0.61: R13.1 R17.1 R18.1 C2.2 10.5,61.9 YV.TP 6.5,59.5 3,56 3,22.5 4.01,21.49 13.49,21.49 18.86,16.12 71.5,16.12 75.56,20.18 75.56,31.5

### Text on the board
Reference: BT AQ DOL R5